# EAGLE schematic schema (EAGLE 9.3.2)

## Sheet 1 of 3
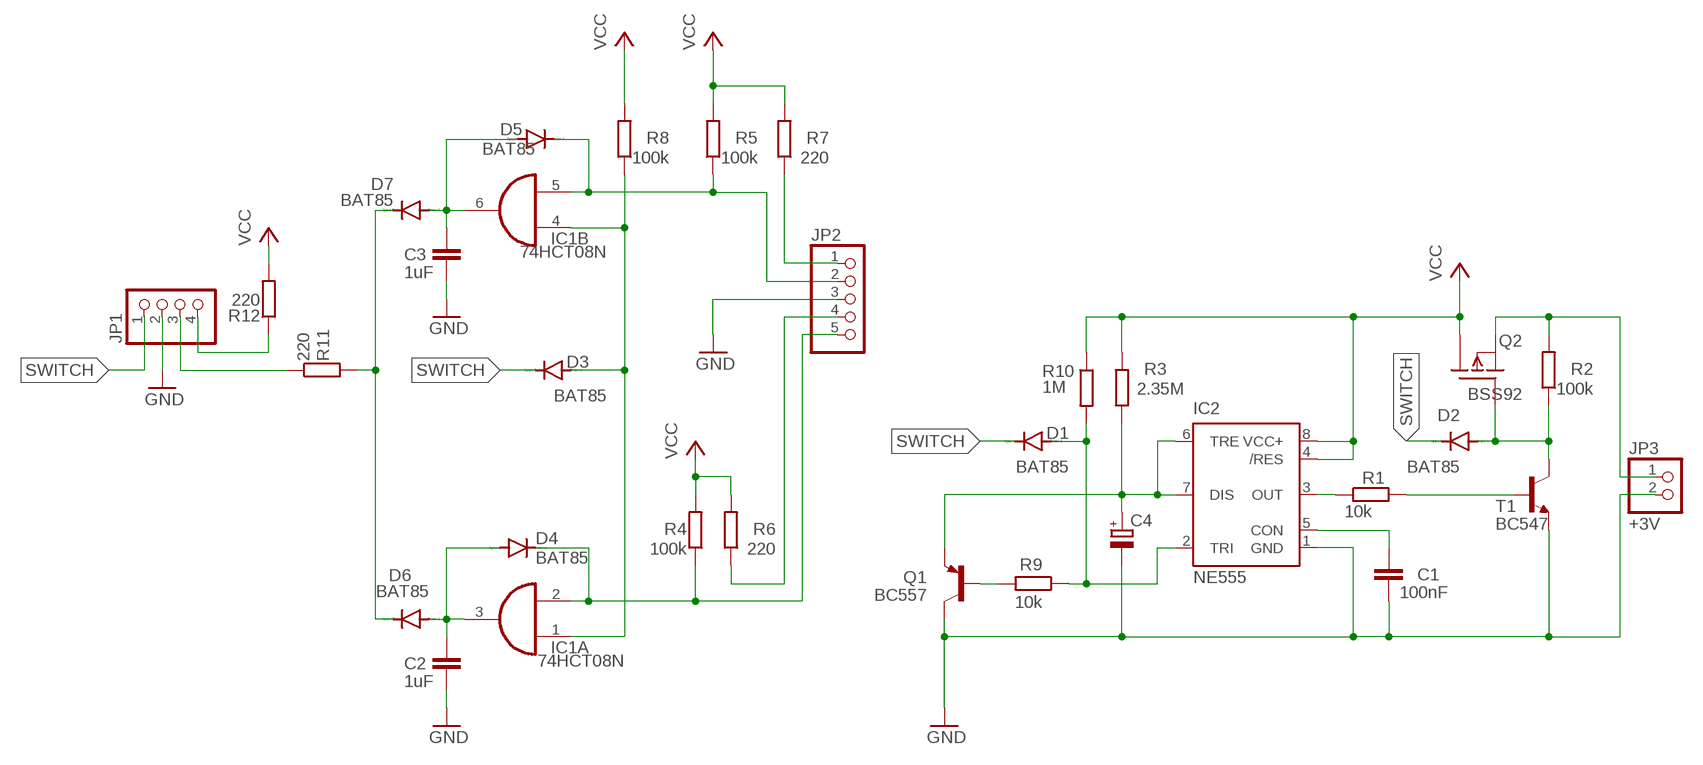
[diagram p0: schematic, sheet 1]

### Parts
C1  100nF  C-EU025-024X044  [C025-024X044]
C2  1uF  C-EU025-024X044  [C025-024X044]
C3  1uF  C-EU025-024X044  [C025-024X044]
C4  CPOL-EUE2,5-6E  [E2,5-6E]
D1  BAT85  BAT81  [DO34-7]
D2  BAT85  BAT81  [DO34-7]
D3  BAT85  BAT81  [DO34-7]
D4  BAT85  BAT81  [DO34-7]
D5  BAT85  BAT81  [DO34-7]
D6  BAT85  BAT81  [DO34-7]
D7  BAT85  BAT81  [DO34-7]
IC1  74HCT08N  [DIL14]
IC2  NE555  [DIL-08]
JP1  PINHD-1X4  [1X04]
JP2  PINHD-1X5  [1X05]
JP3  +3V  PINHD-1X2/90  [1X02/90]
Q1  BC557  [TO92]
Q2  BSS92  [TO92]
R1  10k  R-EU_0204/7  [0204/7]
R2  100k  R-EU_0204/7  [0204/7]
R3  2.35M  R-EU_0204/7  [0204/7]
R4  100k  R-EU_0204/7  [0204/7]
R5  100k  R-EU_0204/7  [0204/7]
R6  220  R-EU_0204/7  [0204/7]
R7  220  R-EU_0204/7  [0204/7]
R8  100k  R-EU_0204/7  [0204/7]
R9  10k  R-EU_0204/7  [0204/7]
R10  1M  R-EU_0204/7  [0204/7]
R11  220  R-EU_0204/7  [0204/7]
R12  220  R-EU_0204/7  [0204/7]
T1  BC547  [TO92]

### Nets
GND: C1.2 C2.2 C3.2 C4.- IC2.1(GND) JP1.2 JP2.3 JP3.2 Q1.3(C) T1.1(E)
N$1: C1.1 IC2.5(CON)
N$2: IC2.3(OUT) R1.1
N$3: R1.2 T1.2(B)
N$4: C4.+ IC2.6(TRE) IC2.7(DIS) Q1.1(E) R3.1
N$5: D2.A Q2.1(G) R2.1 T1.3(C)
N$6: D5.C IC1.5(B:I1) JP2.2 R5.1
N$7: JP2.1 R7.1
N$8: D4.C IC1.2(A:I1) JP2.5 R4.1
N$9: JP2.4 R6.1
N$10: C2.1 D4.A D6.A IC1.3(A:O)
N$12: Q1.2(B) R9.2
N$13: C3.1 D5.A D7.A IC1.6(B:O)
N$14: D1.A IC2.2(TRI) R9.1 R10.2
N$16: D6.C D7.C R11.2
N$19: JP3.1 Q2.3(S) R2.2
N$20: JP1.3 R11.1
N$21: JP1.4 R12.1
N$22: D3.A IC1.1(A:I0) IC1.4(B:I0) R8.1
SWITCH: D1.C D2.C D3.C JP1.1
VCC: IC2.4(/RES) IC2.8(VCC+) Q2.2(D) R3.2 R4.2 R5.2 R6.2 R7.2 R8.2 R10.1 R12.2
Unconnected: IC1.8(C:O) IC1.9(C:I0) IC1.10(C:I1) IC1.11(D:O) IC1.12(D:I0) IC1.13(D:I1)

## Sheet 2 of 3
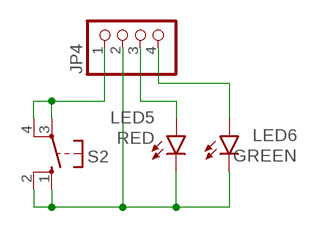
[diagram p1: schematic, sheet 2]

### Parts
JP4  PINHD-1X4  [1X04]
LED5  RED  LED5MM  [LED5MM]
LED6  GREEN  LED5MM  [LED5MM]
S2  10-XX  [B3F-10XX]

### Nets
N$23: JP4.4 LED6.A
N$24: JP4.3 LED5.A
N$25: JP4.1 S2.3(P) S2.4(P1)
N$26: JP4.2 LED5.K(C) LED6.K(C) S2.1(S) S2.2(S1)

## Sheet 3 of 3
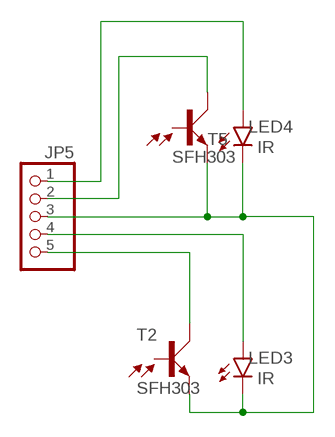
[diagram p2: schematic, sheet 3]

### Parts
JP5  PINHD-1X5  [1X05]
LED3  IR  LED5MM  [LED5MM]
LED4  IR  LED5MM  [LED5MM]
T2  SFH303  [SFH303]
T5  SFH303  [SFH303]

### Nets
N$29: JP5.1 LED4.A
N$30: JP5.2 T5.2(C)
N$31: JP5.5 T2.2(C)
N$32: JP5.4 LED3.A
N$33: JP5.3 LED3.K(C) LED4.K(C) T2.1(E) T5.1(E)
Unconnected: T2.3(B) T5.3(B)

## Power pins joined to a net without a drawn wire
GND: IC1.7(P:GND)
VCC: IC1.14(P:VCC)

## Library data of the parts
C1-C3 = rcl:C-EU: CAPACITOR, European symbol; SPICEPREFIX: C
C4 = rcl:CPOL-EU: POLARIZED CAPACITOR, European symbol; SPICEPREFIX: C
D1-D7 = diode:BAT81: DIODE barrier diode
IC1 = 74xx-eu:74*08: Quad 2-input AND gate
IC2 = st-microelectronics:NE555: General purpose bipolar Timer; MF: Arrow Electronics; MPN: NE555N; OC_FARNELL: 1467742; OC_NEWARK: 89K1486
JP1 JP4 = pinhead:PINHD-1X4: PIN HEADER
JP2 JP5 = pinhead:PINHD-1X5: PIN HEADER
JP3 = pinhead:PINHD-1X2: PIN HEADER
LED3-LED6 = led:LED: LED OSRAM: - CHIPLED LG R971, LG N971, LY N971, LG Q971, LY Q971, LO R971, LY R971 LH N974, LH R974 LS Q976, LO Q976, LY Q976 LO Q996 - Hyper CHIPLED LW Q18S LB Q993, LB Q99A, LB R99A - SideLED LS A670, LO A670, LY A670, LG A670, LP A670 LB A673, LV A673, LT A673, LW A673 LH A674 LY A675 LS A676, LA A676, LO A676, LY A676, LW A676 LS A679, LY A679, LG A679 - Hyper Micro SIDELED® LS Y876, LA Y876, LO Y876, LY Y876 LT Y87S - SmartLED LW L88C, LW L88S LB L89C, LB L89S, LG L890 LS L89K, LO L89K, LY L89K LS L896, LA L896, LO L896, LY L896 - TOPLED LS T670, LO T670, LY T670, LG T670, LP T670 LSG T670, LSP T670, LSY T670, LOP T670, LYG T670 LG T671, LOG T671, LSG T671 LB T673, LV T673, LT T673, LW T673 LH T674 LS T676, LA T676, LO T676, LY T676, LB T676, LH T676, LSB T676, LW T676 LB T67C, LV T67C, LT T67C, LS T67K, LO T67K, LY T67K, LW E67C LS E67B, LA E67B, LO E67B, LY E67B, LB E67C, LV E67C, LT E67C LW T67C LS T679, LY T679, LG T679 LS T770, LO T770, LY T770, LG T770, LP T770 LB T773, LV T773, LT T773, LW T773 LH T774 LS E675, LA E675, LY E675, LS T675 LS T776, LA T776, LO T776, LY T776, LB T776 LHGB T686 LT T68C, LB T68C - Hyper Mini TOPLED® LB M676 - Mini TOPLED Santana® LG M470 LS M47K, LO M47K, LY M47K Source: http://www.osram.convergy.de LUXEON: - LUMILED® LXK2-PW12-R00, LXK2-PW12-S00, LXK2-PW14-U00, LXK2-PW14-V00 LXK2-PM12-R00, LXK2-PM12-S00, LXK2-PM14-U00 LXK2-PE12-Q00, LXK2-PE12-R00, LXK2-PE12-S00, LXK2-PE14-T00, LXK2-PE14-U00 LXK2-PB12-K00, LXK2-PB12-L00, LXK2-PB12-M00, LXK2-PB14-N00, LXK2-PB14-P00, LXK2-PB14-Q00 LXK2-PR12-L00, LXK2-PR12-M00, LXK2-PR14-Q00, LXK2-PR14-R00 LXK2-PD12-Q00, LXK2-PD12-R00, LXK2-PD12-S00 LXK2-PH12-R00, LXK2-PH12-S00 LXK2-PL12-P00, LXK2-PL12-Q00, LXK2-PL12-R00 Source: www.luxeon.com KINGBRIGHT: KA-3528ASYC Source: www.kingbright.com
Q1 = transistor-pnp:BC557: PNP Transistor
Q2 = transistor-fet:BSS92: P-Channel Enhancement MOSFET -200V; -0,15A; 11Ohm
R1-R12 = rcl:R-EU_: RESISTOR, European symbol; SPICEPREFIX: R
S2 = switch-omron:10-XX: OMRON SWITCH; MPN: B3F-1000; OC_FARNELL: 176432; OC_NEWARK: 36M3542
T1 = transistor:BC547: NPN TRANSISTOR
T2 T5 = opto-trans-siemens:SFH303: Silicium NPN Phototransistor Source: Siemens; OC_FARNELL: unknown; OC_NEWARK: unknown